# EAGLE design InsideLift (EAGLE 9.5.0)
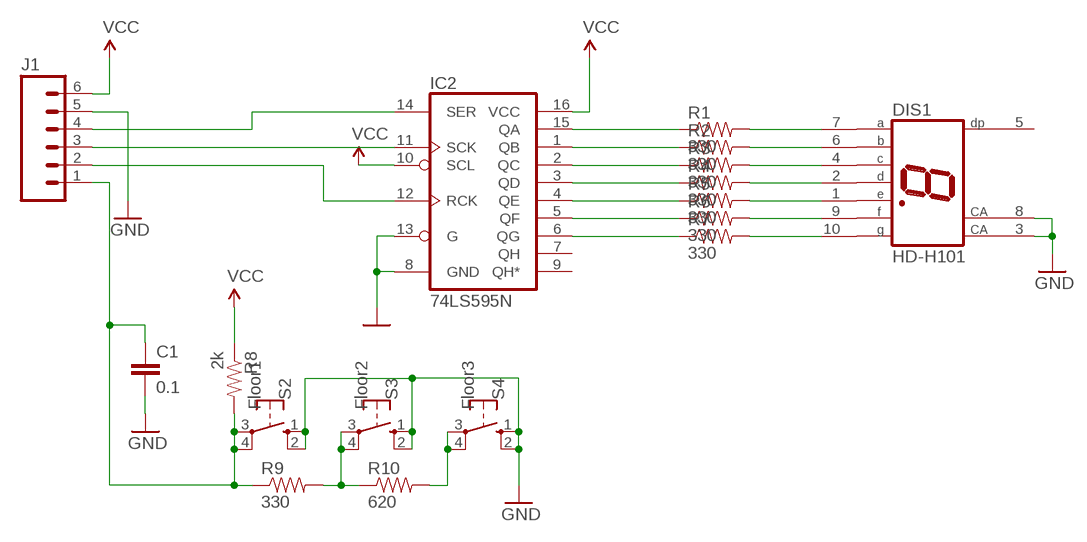
[diagram p0: schematic, sheet 1]

## Parts
C1  0.1  CAPPTH1  [CAP-PTH-5MM]
DIS1  HD-H101  [HDSP-M]
IC2  74LS595N  [DIL16]
J1  M06LONGPADS  [1X06_LONGPADS]
R1  330  RESISTORAXIAL-0.3  [AXIAL-0.3]
R2  330  RESISTORAXIAL-0.3  [AXIAL-0.3]
R3  330  RESISTORAXIAL-0.3  [AXIAL-0.3]
R4  330  RESISTORAXIAL-0.3  [AXIAL-0.3]
R5  330  RESISTORAXIAL-0.3  [AXIAL-0.3]
R6  330  RESISTORAXIAL-0.3  [AXIAL-0.3]
R7  330  RESISTORAXIAL-0.3  [AXIAL-0.3]
R8  2k  RESISTOR0805-RES  [0805]
R9  330  RESISTOR0805-RES  [0805]
R10  620  RESISTOR0805-RES  [0805]
S2  Floor1  10-XX  [B3F-10XX]
S3  Floor2  10-XX  [B3F-10XX]
S4  Floor3  10-XX  [B3F-10XX]

## Nets
A0: C1.1 J1.1 R8.2 R9.1 S2.3(P) S2.4(P1)
GND: C1.2 DIS1.3(CA) DIS1.8(CA) IC2.8(GND) IC2.13(G) J1.5 S2.1(S) S2.2(S1) S3.1(S) S3.2(S1) S4.1(S) S4.2(S1)
N$1: IC2.14(SER) J1.4
N$2: R9.2 R10.1 S3.3(P) S3.4(P1)
N$3: R10.2 S4.3(P) S4.4(P1)
N$5: IC2.15(QA) R1.P$1
N$6: IC2.1(QB) R2.P$1
N$7: IC2.2(QC) R3.P$1
N$8: IC2.3(QD) R4.P$1
N$9: IC2.4(QE) R5.P$1
N$10: IC2.5(QF) R6.P$1
N$11: IC2.6(QG) R7.P$1
N$12: DIS1.7(A) R1.P$2
N$13: DIS1.6(B) R2.P$2
N$14: DIS1.4(C) R3.P$2
N$15: DIS1.2(D) R4.P$2
N$16: DIS1.1(E) R5.P$2
N$17: DIS1.9(F) R6.P$2
N$18: DIS1.10(G) R7.P$2
N$49: IC2.11(SCK) J1.3
N$50: IC2.12(RCK) J1.2
VCC: IC2.10(SCL) IC2.16(VCC) J1.6 R8.1
Unconnected: DIS1.5(DP) IC2.7(QH) IC2.9(QH*)

## Library data of the parts
C1 = SparkFun:CAP: Capacitor Standard 0603 ceramic capacitor, and 0.1" leaded capacitor.
DIS1 = display-hp:HD-H101: LED DISPLAY 1-character 7 segment, decimal point right; OC_FARNELL: unknown; OC_NEWARK: unknown
IC2 = SparkFun-DigitalIC:74*595: 8-bit SHIFT REGISTER, output latch
J1 = ES-CONNECTOR:M06: Header 6 Standard 6-pin 0.1" header. Use with straight break away headers (SKU : PRT-00116), right angle break away headers (PRT-00553), swiss pins (PRT-00743), machine pins (PRT-00117), and female headers (PRT-00115). Molex polarized connector foot print use with SKU : PRT-08094 with associated crimp pins and housings. NOTES ON THE VARIANTS LOCK and LOCK_LONGPADS... This footprint was designed to help hold the alignment of a through-hole component (i.e. 6-pin header) while soldering it into place. You may notice that each hole has been shifted either up or down by 0.005 of an inch from it's more standard position (which is a perfectly straight line). This slight alteration caused the pins (the squares in the middle) to touch the edges of the holes. Because they are alternating, it causes a "brace" to hold the component in place. 0.005 has proven to be the perfect amount of "off-center" position when using our standard breakaway headers. Although looks a little odd when you look at the bare footprint, once you have a header in there, the alteration is very hard to notice. Also,if you push a header all the way into place, it is covered up entirely on the bottom side. This idea of altering the position of holes to aid alignment will be further integrated into the Sparkfun Library for other footprints. It can help hold any component with 3 or more connection pins.
R1-R7 = SparkFun-Resistors:RESISTOR: Resistor Basic schematic elements and footprints for 0603, 1206, and PTH resistors.
R8-R10 = SparkFun-Passives:RESISTOR: Resistor Basic schematic elements and footprints for 0603, 1206, and PTH resistors.
S2-S4 = switch-omron:10-XX: OMRON SWITCH; MPN: B3F-1000; OC_FARNELL: 176432; OC_NEWARK: 36M3542

## Board
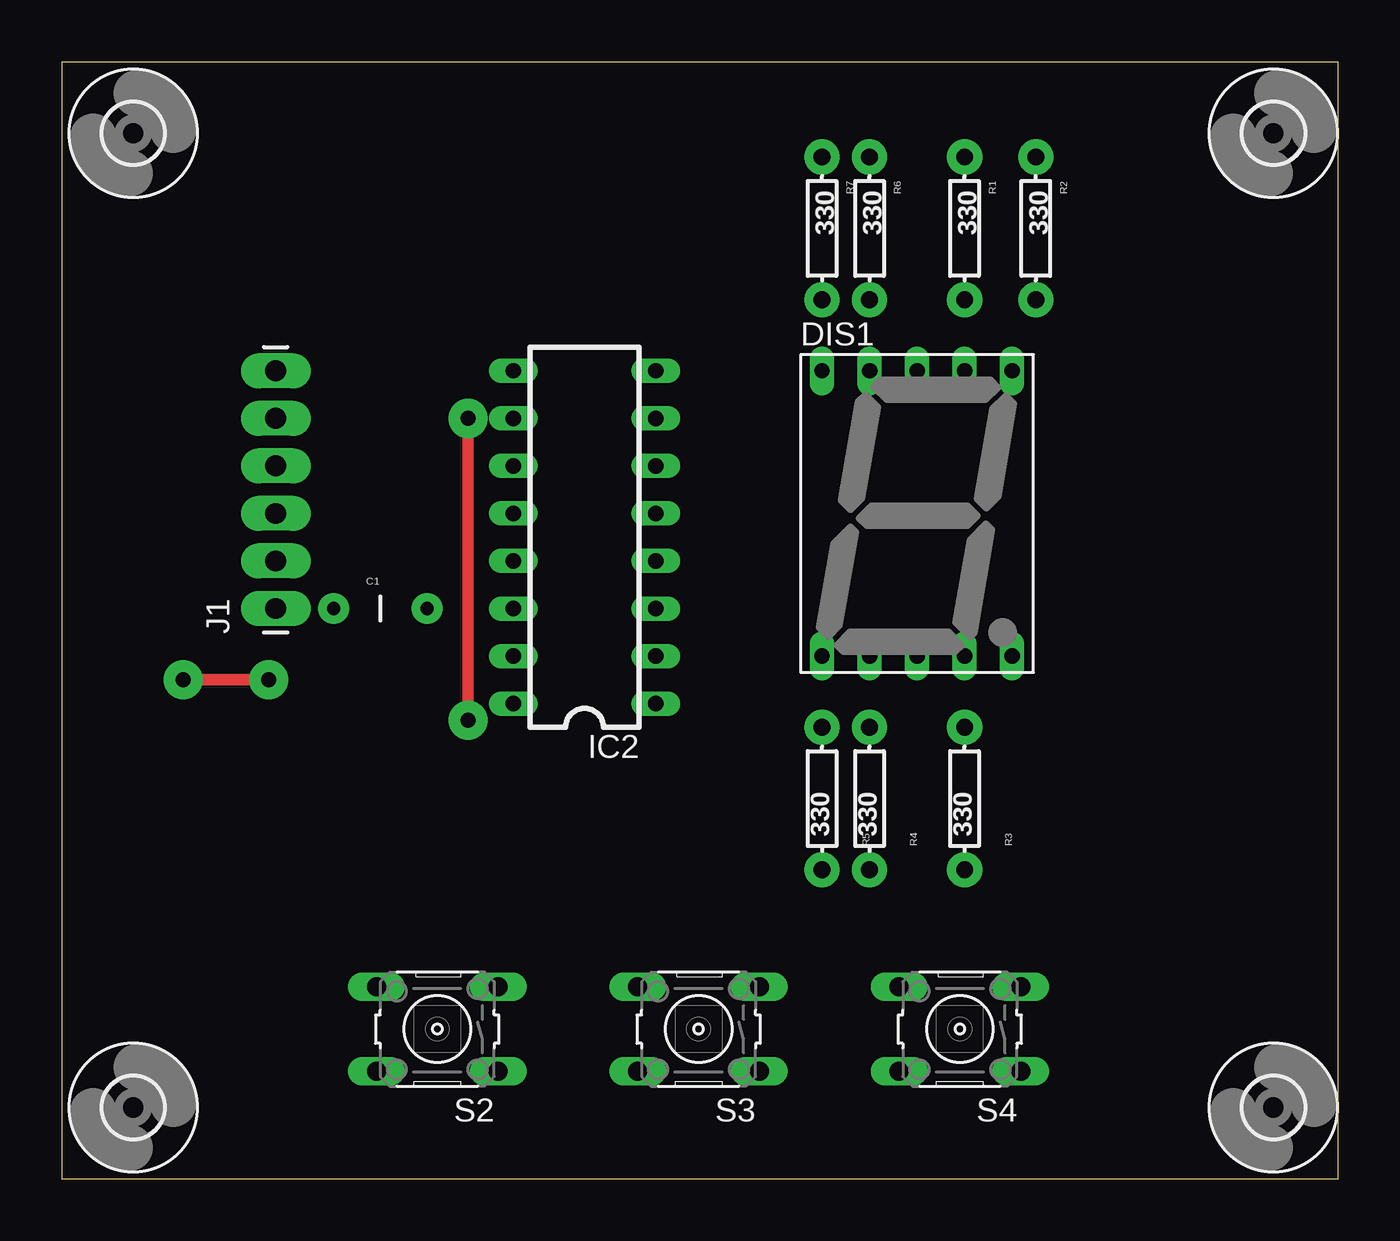
[diagram p1: board, top side]
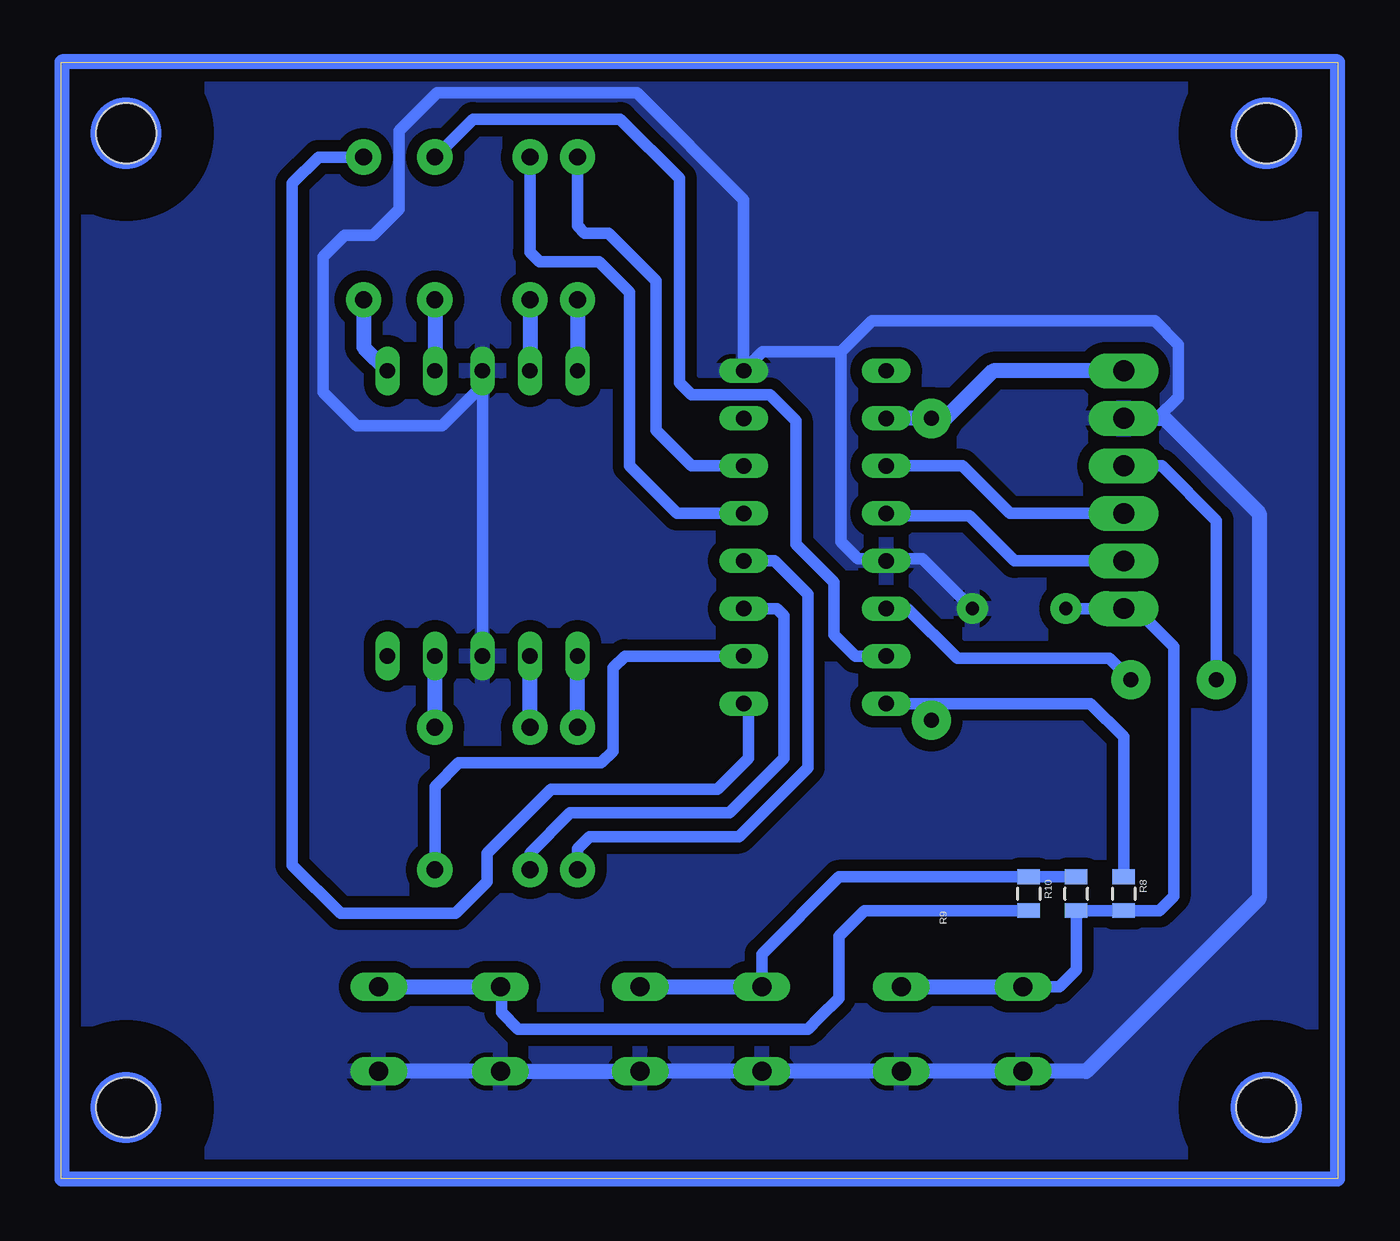
[diagram p2: board, bottom side, seen from below]

Size 68.25 x 59.68 mm. Coordinates in mm from the lower left corner, seen from the top.
Outline: 0,0 68.25,0 68.25,59.68 0,59.68 0,0
Copper layers (1*16): Top 0.035mm / dielectric 1.5mm / Bottom 0.035mm
Design rules "default": minimum track width 6mil, minimum drill 0.35mm, track to track 6mil, track to pad 6mil, pad to pad 6mil, via to via 6mil, smd to smd 6mil, copper to edge 40mil, drill to drill 6mil, minimum pad ring 10mil, minimum via ring 8mil, stop-mask expansion 4mil, vias tented up to drill 0mil, thermal gap 10mil

### Footprints (pad centres in the part's own frame; a part is rotated, then mirrored left to right if it is on the bottom)
CAP-PTH-5MM = drill 0.7 pad 1.651: 1 -2.5,0; 2 2.5,0
HDSP-M = drill 0.813 long: 1 -5.08,-7.62; 2 -2.54,-7.62; 3 0,-7.62; 4 2.54,-7.62; 5 5.08,-7.62; 6 5.08,7.62; 7 2.54,7.62; 8 0,7.62; 9 -2.54,7.62; 10 -5.08,7.62
DIL16 = drill 0.813 long: 1 -8.89,-3.81; 2 -6.35,-3.81; 3 -3.81,-3.81; 4 -1.27,-3.81; 5 1.27,-3.81; 6 3.81,-3.81; 7 6.35,-3.81; 8 8.89,-3.81; 9 8.89,3.81; 10 6.35,3.81; 11 3.81,3.81; 12 1.27,3.81; 13 -1.27,3.81; 14 -3.81,3.81; 15 -6.35,3.81; 16 -8.89,3.81
1X06_LONGPADS = drill 1.118 pad 1.88 long: 1 0,0; 2 2.54,0; 3 5.08,0; 4 7.62,0; 5 10.16,0; 6 12.7,0
AXIAL-0.3 = drill 0.9 pad 1.88: P$1 -3.81,0; P$2 3.81,0
0805 = smd 0.8 x 1.2: 1 -0.9,0; 2 0.9,0
B3F-10XX = drill 1.016 long: 1 -3.251,2.261; 2 3.251,2.261; 3 -3.251,-2.261; 4 3.251,-2.261
3,2 = hole 3.2: 0,0

### Placement (x,y rotation side)
C1  17.02,30.48 0 top
DIS1  45.72,35.56 0 top
IC2  27.94,34.29 90 top
J1  11.43,30.48 90 top
R1  48.26,50.8 270 top
R2  52.07,50.8 270 top
R3  48.26,20.32 90 top
R4  43.18,20.32 90 top
R5  40.64,20.32 90 top
R6  43.18,50.8 270 top
R7  40.64,50.8 270 top
R8  11.43,15.24 270 bottom
R9  13.97,15.24 90 bottom
R10  16.51,15.24 270 bottom
S2  20.07,8 180 top
S3  34.04,8 180 top
S4  48.01,8 180 top
U$1  [3,2]  3.81,3.81 0 top
U$2  [3,2]  64.77,3.81 0 top
U$3  [3,2]  64.77,55.88 0 top
U$4  [3,2]  3.81,55.88 0 top

### Tracks (layer width: path | path; a pad name or v marks a point on that pad's centre or on a via)
A0
  Bottom 0.61: 13.8,14.17 R9.1 13.97,11.18 14.88,10.26 S2.4 | 13.8,14.17 13.76,14.34 | 17.29,10.5 17.53,10.26 | C1.1 J1.1 10.79,30.48 8.76,28.45 8.76,15.11 9.54,14.34 R8.2 13.63,14.34 13.8,14.17
  Bottom 0.813: S2.3 17.53,10.26 S2.4
GND
  Bottom 0.61: J1.5 9.65,40.64 8.51,41.78 8.51,44.58 9.78,45.85 24.89,45.85 26.54,44.2 | 26.54,44.2 26.54,34.04 25.65,33.15 24.26,33.15 | 24.26,33.15 IC2.13 | 26.54,44.2 30.73,44.2 IC2.8 31.75,52.32 37.46,58.04 48.13,58.04 50.16,56.01 50.16,51.82 51.56,50.42 53.09,50.42 54.23,49.28 54.23,42.04 52.45,40.26 47.88,40.26 45.72,42.42 DIS1.8 DIS1.3 | C1.2 20.55,31.52 22.19,33.15 24.26,33.15
  Bottom 0.813: 10.29,40.64 J1.5 9.27,40.64 4.19,35.56 4.19,14.99 13.44,5.74 S2.2 S2.1 S3.2 S3.1 S4.2 S4.1
  pour Bottom (isolate 0.61): 0,59.69 68.33,59.69 68.33,0 0,0
N$1  (via drill 0.8 pad 2.1)
  Top 0.61: v6.48,26.67 v11.05,26.67
  Bottom 0.61: J1.4 9.4,38.1 6.48,35.18 v6.48,26.67 | v11.05,26.67 12.19,27.81 19.05,27.81 20.32,27.81 22.99,30.48 IC2.14
N$2
  Bottom 0.61: R9.2 R10.1 26.66,16.14 30.78,12.01 S3.4
  Bottom 0.813: S3.3 S3.4
N$3
  Bottom 0.61: 45.21,10.26 45.11,10.16 44.7,10.16 44.7,8.89 43.81,8 28.32,8 27.69,8.64 26.67,9.65 26.67,12.95 25.28,14.34 R10.2
  Bottom 0.813: S4.3 45.21,10.26 S4.4
N$5
  Bottom 0.61: R1.P$1 46.23,56.64 38.35,56.64 35.18,53.47 35.18,42.55 34.54,41.91 30.35,41.91 28.96,40.51 28.96,33.91 26.92,31.88 26.92,29.08 25.78,27.94 IC2.15
N$6
  Bottom 0.61: R2.P$1 54.48,54.61 55.88,53.21 55.88,16.76 53.31,14.2 47.14,14.2 45.47,15.88 45.47,17.4 42.04,20.83 33.15,20.83 31.5,22.48 31.5,25.15 IC2.1
N$7
  Bottom 0.61: R3.P$1 48.26,20.95 46.99,22.22 39.37,22.22 38.73,22.86 38.73,27.3 38.1,27.94 IC2.2
N$8
  Bottom 0.61: R4.P$1 43.18,17.4 41.02,19.56 32.51,19.56 29.59,22.48 29.59,30.1 29.97,30.48 IC2.3
N$9
  Bottom 0.61: R5.P$1 40.64,17.65 40,18.29 32,18.29 28.32,21.97 28.32,31.24 30.1,33.02 IC2.4
N$10
  Bottom 0.61: R6.P$1 43.18,49.53 42.67,49.02 39.5,49.02 37.85,47.37 37.85,38.1 35.31,35.56 IC2.5
N$11
  Bottom 0.61: R7.P$1 40.64,50.93 40.26,50.55 38.99,50.55 36.45,48.01 36.45,40.01 34.54,38.1 IC2.6
N$12
  Bottom 0.813: R1.P$2 DIS1.7
N$13
  Bottom 0.813: R2.P$2 52.07,44.45 DIS1.6
N$14
  Bottom 0.813: R3.P$2 DIS1.4
N$15
  Bottom 0.813: R4.P$2 DIS1.2
N$16
  Bottom 0.813: R5.P$2 DIS1.1
N$17
  Bottom 0.813: R6.P$2 DIS1.9
N$18
  Bottom 0.813: R7.P$2 DIS1.10
N$19
  Bottom 0.813: 0,59.69 68.2,59.69 68.2,0 0,0 0,59.69
N$49
  Bottom 0.61: J1.3 17.53,35.56 20.07,38.1 IC2.11
N$50
  Bottom 0.61: J1.2 17.27,33.02 19.69,35.43 24,35.43 IC2.12
VCC  (via drill 0.8 pad 2.1)
  Top 0.61: v21.72,24.51 v21.72,40.64
  Bottom 0.61: R8.1 11.43,23.62 13.21,25.4 19.05,25.4 21.59,25.4 | 21.59,25.4 IC2.16 | 21.59,25.4 21.72,25.27 v21.72,24.51
  Bottom 0.813: J1.6 18.41,43.18 20.95,40.64 v21.72,40.64 IC2.10
(copper drawn outside any net)
  shapes: Bottom circle x4